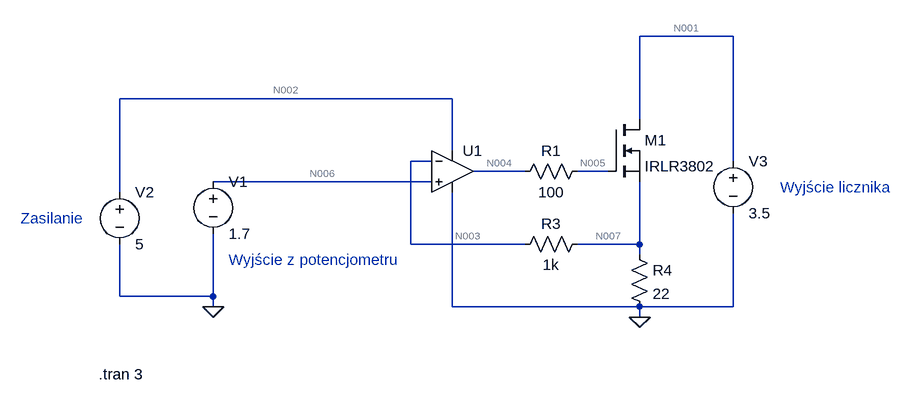
[diagram p0: schematic fuel_temp_test.asc]
fuel_temp_test.asc, the LTspice schematic file:
Version 4.1
SHEET 1 880 680
WIRE 608 -528 464 -528
WIRE 176 -432 -336 -432
WIRE 464 -400 464 -528
WIRE 176 -352 176 -432
WIRE 144 -336 112 -336
WIRE 608 -336 608 -528
WIRE 288 -320 208 -320
WIRE 416 -320 368 -320
WIRE 144 -304 -192 -304
WIRE -336 -288 -336 -432
WIRE 112 -208 112 -336
WIRE 288 -208 112 -208
WIRE 464 -208 464 -304
WIRE 464 -208 368 -208
WIRE 464 -192 464 -208
WIRE -336 -128 -336 -208
WIRE -192 -128 -192 -224
WIRE -192 -128 -336 -128
WIRE -192 -112 -192 -128
WIRE 176 -112 176 -288
WIRE 464 -112 176 -112
WIRE 608 -112 608 -256
WIRE 608 -112 464 -112
WIRE 464 -96 464 -112
FLAG -192 -112 0
FLAG 464 -96 0
SYMBOL OpAmps\\UniversalOpAmp 176 -320 R0
SYMATTR InstName U1
SYMBOL voltage -336 -304 R0
WINDOW 123 0 0 Left 0
WINDOW 39 0 0 Left 0
SYMATTR InstName V2
SYMATTR Value 5
SYMBOL voltage 608 -352 R0
WINDOW 123 0 0 Left 0
WINDOW 39 0 0 Left 0
SYMATTR InstName V3
SYMATTR Value 3.5
SYMBOL res 384 -336 R90
WINDOW 0 0 56 VBottom 2
WINDOW 3 32 56 VTop 2
SYMATTR InstName R1
SYMATTR Value 100
SYMBOL res 384 -224 R90
WINDOW 0 0 56 VBottom 2
WINDOW 3 32 56 VTop 2
SYMATTR InstName R3
SYMATTR Value 1k
SYMBOL res 448 -208 R0
SYMATTR InstName R4
SYMATTR Value 22
SYMBOL nmos 416 -400 R0
SYMATTR InstName M1
SYMATTR Value IRLR3802
SYMBOL voltage -192 -320 R0
WINDOW 123 0 0 Left 0
WINDOW 39 0 0 Left 0
SYMATTR InstName V1
SYMATTR Value 1.7
TEXT -368 -8 Left 2 !.tran 3
TEXT 680 -296 Left 2 ;Wyjście licznika
TEXT -488 -248 Left 2 ;Zasilanie
TEXT -168 -184 Left 2 ;Wyjście z potencjometru

The netlist it stands for:
* fuel_temp_test.asc
X§U1 N006 N003 N002 0 N004 level1 Avol=1Meg GBW=10Meg Vos=0 En=0 Enk=0 In=0 Ink=0 Rin=500Meg  ; pins In+ In- V+ V- OUT
V2 N002 0 5
V3 N001 0 3.5
R1 N005 N004 100
R3 N007 N003 1k
R4 N007 0 22
M1 N001 N005 N007 N007 IRLR3802
V1 N006 0 1.7
.model NMOS NMOS
.model PMOS PMOS
.lib standard.mos
.tran 3
* Wyjście licznika
* Zasilanie
* Wyjście z potencjometru
.lib UniversalOpAmp1.lib
.backanno
.end

* Results of the author's LTspice run, read from the files saved beside the schematic
* Operating Point, zero values left out:
*   V(n001) = 3.5 V
*   V(n002) = 5 V
*   V(n003) = 1.7 V
*   V(n004) = 3.053 V
*   V(n005) = 3.053 V
*   V(n006) = 1.7 V
*   V(n007) = 1.7 V
*   I(R3) = -1.6 nA
*   I(R4) = 77.27 mA
*   I(V1) = 1.6 nA
*   I(V2) = -6.6 nA
*   I(V3) = -77.27 mA
*   Id(M1) = 77.27 mA
*   Is(M1) = -77.27 mA
*   Ix(u1:1) = -1.6 nA
*   Ix(u1:2) = -1.6 nA
*   Ix(u1:3) = 6.6 nA
*   Ix(u1:4) = -3.4 nA
*   Ix(u1:5) = 1.848 nA